# Altium schematic sheet main.SchDoc: Hefesto
size A4; CheckedBy: None; DrawnBy: David, Andrea; DocumentNumber: 1; Revision: v1.0; SheetNumber: 1; SheetTotal: 7; Company: ETSIT; VersionRevision: v1.0; Project: Hefesto; TotalSheet: 7
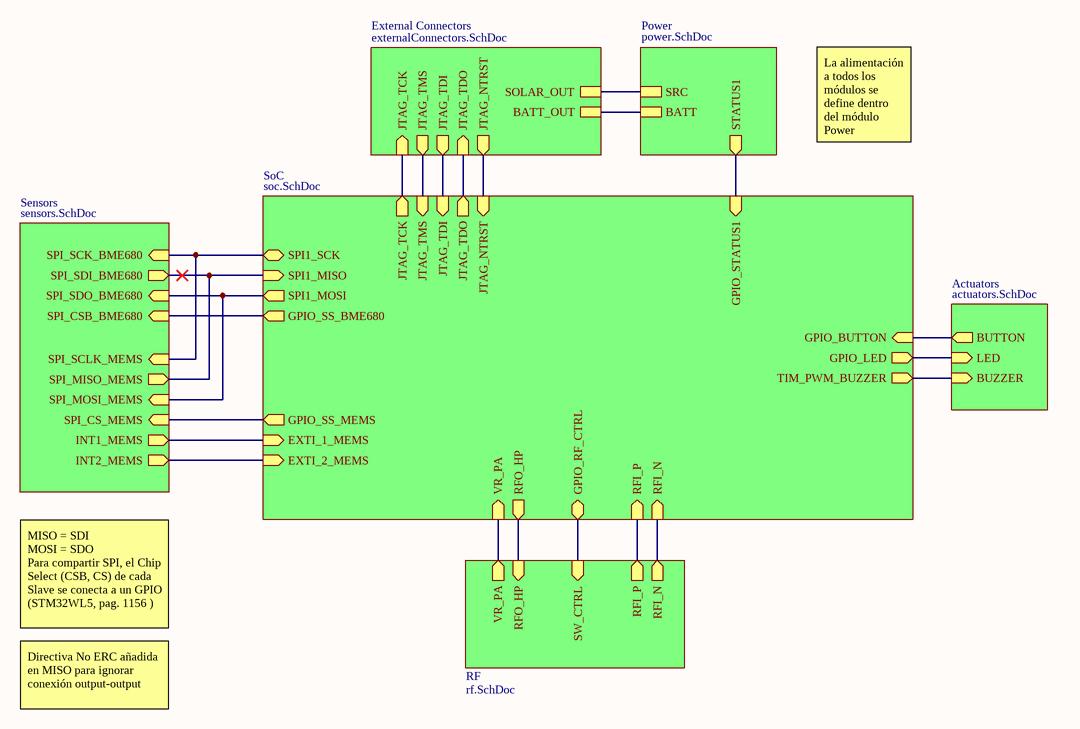
[diagram p0: main.SchDoc]

## Sub-sheets
Actuators = actuators.SchDoc: BUTTON (out), LED (in), BUZZER (in)
External Connectors = externalConnectors.SchDoc: SOLAR_OUT, BATT_OUT, JTAG_TCK (in), JTAG_TMS (out), JTAG_TDI (out), JTAG_TDO (in), JTAG_NTRST (out)
Power = power.SchDoc: SRC, BATT, STATUS1 (out)
RF = rf.SchDoc: VR_PA (out), RFO_HP (in), RFI_P (out), RFI_N (out), SW_CTRL (in)
Sensors = sensors.SchDoc: SPI_SCLK_MEMS (in), SPI_MISO_MEMS (out), SPI_MOSI_MEMS (in), SPI_CS_MEMS (in), INT1_MEMS (out), INT2_MEMS (out), SPI_SCK_BME680 (in), SPI_SDI_BME680 (out), SPI_SDO_BME680 (in), SPI_CSB_BME680 (in)
SoC = soc.SchDoc: GPIO_BUTTON (in), GPIO_LED (out), TIM_PWM_BUZZER (out), GPIO_STATUS1 (in), JTAG_TCK (out), JTAG_TMS (in), JTAG_TDI (in), JTAG_TDO (out), SPI1_SCK (bidir), SPI1_MISO (in), SPI1_MOSI (out), GPIO_SS_BME680 (out), EXTI_1_MEMS (in), EXTI_2_MEMS (in), GPIO_SS_MEMS (out), VR_PA (in), RFO_HP (out), RFI_P (in), RFI_N (in), GPIO_RF_CTRL (bidir), JTAG_NTRST (in)

## Nets
(unnamed): sheet SoC/GPIO_BUTTON, sheet Actuators/BUTTON
(unnamed): sheet SoC/GPIO_LED, sheet Actuators/LED
(unnamed): sheet SoC/TIM_PWM_BUZZER, sheet Actuators/BUZZER
(unnamed): sheet SoC/GPIO_STATUS1, sheet Power/STATUS1
(unnamed): sheet SoC/JTAG_TCK, sheet External Connectors/JTAG_TCK
(unnamed): sheet SoC/JTAG_TMS, sheet External Connectors/JTAG_TMS
(unnamed): sheet SoC/JTAG_TDI, sheet External Connectors/JTAG_TDI
(unnamed): sheet SoC/JTAG_TDO, sheet External Connectors/JTAG_TDO
(unnamed): sheet SoC/SPI1_SCK, sheet Sensors/SPI_SCLK_MEMS, sheet Sensors/SPI_SCK_BME680
(unnamed): sheet SoC/SPI1_MISO, sheet Sensors/SPI_MISO_MEMS, sheet Sensors/SPI_SDI_BME680
(unnamed): sheet SoC/SPI1_MOSI, sheet Sensors/SPI_MOSI_MEMS, sheet Sensors/SPI_SDO_BME680
(unnamed): sheet SoC/GPIO_SS_BME680, sheet Sensors/SPI_CSB_BME680
(unnamed): sheet SoC/EXTI_1_MEMS, sheet Sensors/INT1_MEMS
(unnamed): sheet SoC/EXTI_2_MEMS, sheet Sensors/INT2_MEMS
(unnamed): sheet SoC/GPIO_SS_MEMS, sheet Sensors/SPI_CS_MEMS
(unnamed): sheet SoC/VR_PA, sheet RF/VR_PA
(unnamed): sheet SoC/RFO_HP, sheet RF/RFO_HP
(unnamed): sheet SoC/RFI_P, sheet RF/RFI_P
(unnamed): sheet SoC/RFI_N, sheet RF/RFI_N
(unnamed): sheet SoC/GPIO_RF_CTRL, sheet RF/SW_CTRL
(unnamed): sheet SoC/JTAG_NTRST, sheet External Connectors/JTAG_NTRST
(unnamed): sheet Power/SRC, sheet External Connectors/SOLAR_OUT
(unnamed): sheet Power/BATT, sheet External Connectors/BATT_OUT

## Notes on the sheet
- La alimentación a todos los módulos se define dentro del módulo Power
- MISO = SDI                    MOSI = SDO                                                                                            Para compartir SPI, el Chip Select (CSB, CS) de cada Slave se conecta a un GPIO (STM32WL5, pag. 1156 )
- Directiva No ERC añadida en MISO para ignorar conexión output-output
- Title:
- Drawn By:
- Page Contents:
- Checked By:
- Size:
- Date:
- File:
- License:
- Email:
- A4
- Number:
- Time:
- Revision:
- Sheet
- Website:
- of